# Altium schematic sheet Télécommande.SchDoc
size A4
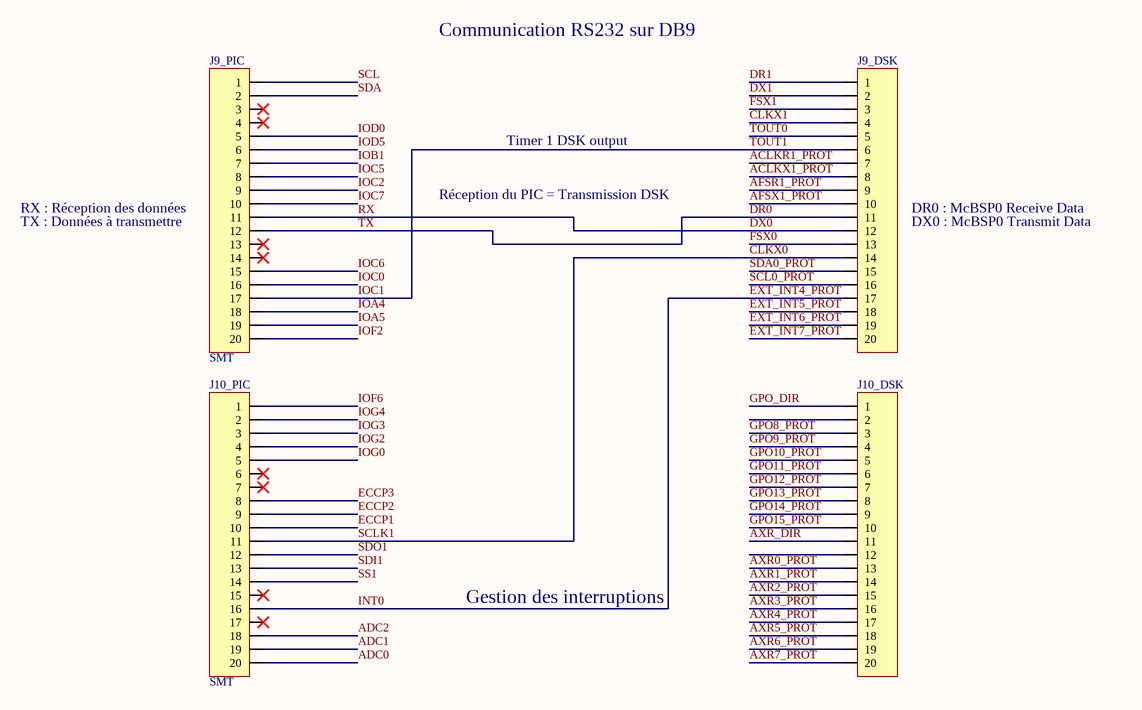
[diagram p0: Télécommande.SchDoc]

## Parts
J9_DSK  Conn20pinsF  [Conn_20_SMT]  (value not drawn)
J9_PIC  Package: SMT  [Conn_20_SMT]  (hidden comment: Conn20pinsF)
J10_DSK  Conn20pinsF  [Conn_20_SMT]  (value not drawn)
J10_PIC  Package: SMT  [Conn_20_SMT]  (hidden comment: Conn20pinsF)

## Nets
ACLKR1_PROT: J9_DSK.7
ACLKX1_PROT: J9_DSK.8
ADC0: J10_PIC.20
ADC1: J10_PIC.19
ADC2: J10_PIC.18
AFSR1_PROT: J9_DSK.9
AFSX1_PROT: J9_DSK.10
AXR0_PROT: J10_DSK.13
AXR1_PROT: J10_DSK.14
AXR2_PROT: J10_DSK.15
AXR3_PROT: J10_DSK.16
AXR4_PROT: J10_DSK.17
AXR5_PROT: J10_DSK.18
AXR6_PROT: J10_DSK.19
AXR7_PROT: J10_DSK.20
AXR_DIR: J10_DSK.11
CLKX0: J9_DSK.14 J10_PIC.11  [also labelled SCLK1]
CLKX1: J9_DSK.4
DR0: J9_DSK.11 J9_PIC.12  [also labelled TX]
DR1: J9_DSK.1
DX0: J9_DSK.12 J9_PIC.11  [also labelled RX]
DX1: J9_DSK.2
ECCP1: J10_PIC.10
ECCP2: J10_PIC.9
ECCP3: J10_PIC.8
EXT_INT4_PROT: J9_DSK.17 J10_PIC.16  [also labelled INT0]
EXT_INT5_PROT: J9_DSK.18
EXT_INT6_PROT: J9_DSK.19
EXT_INT7_PROT: J9_DSK.20
FSX0: J9_DSK.13
FSX1: J9_DSK.3
GPO8_PROT: J10_DSK.3
GPO9_PROT: J10_DSK.4
GPO10_PROT: J10_DSK.5
GPO11_PROT: J10_DSK.6
GPO12_PROT: J10_DSK.7
GPO13_PROT: J10_DSK.8
GPO14_PROT: J10_DSK.9
GPO15_PROT: J10_DSK.10
GPO_DIR: J10_DSK.1
IOA4: J9_PIC.18
IOA5: J9_PIC.19
IOB1: J9_PIC.7
IOC0: J9_PIC.16
IOC1: J9_DSK.6 J9_PIC.17  [also labelled TOUT1]
IOC2: J9_PIC.9
IOC5: J9_PIC.8
IOC6: J9_PIC.15
IOC7: J9_PIC.10
IOD0: J9_PIC.5
IOD5: J9_PIC.6
IOF2: J9_PIC.20
IOF6: J10_PIC.1
IOG0: J10_PIC.5
IOG2: J10_PIC.4
IOG3: J10_PIC.3
IOG4: J10_PIC.2
SCL: J9_PIC.1
SCL0_PROT: J9_DSK.16
SDA: J9_PIC.2
SDA0_PROT: J9_DSK.15
SDI1: J10_PIC.13
SDO1: J10_PIC.12
SS1: J10_PIC.14
TOUT0: J9_DSK.5

Not connected (* = marked no-connect by the designer): J9_PIC 3* 4* 13* 14*; J10_DSK 2 12; J10_PIC 6* 7* 15* 17*

## Notes on the sheet
- Communication RS232 sur DB9
- Timer 1 DSK output
- (near J9_PIC) RX : Réception des données
- Réception du PIC = Transmission DSK
- DR0 : McBSP0 Receive Data
- (near J9_PIC) TX : Données à transmettre
- DX0 : McBSP0 Transmit Data
- Gestion des interruptions

## Library data of the parts
J9_DSK J9_PIC J10_DSK J10_PIC = Conn20pinsF: Connecteur 20 pins F - pitch = 100mils; Manufacturer: Sullins Connector Solutions; Mfg Part Number: NPTC102KFMS-RC; Precision: *; Voltage: *; Current: *; Power: *; HelpURL: https://media.digikey.com/pdf/Data%20Sheets/Sullins%20PDFs/NPxCxx2KFMx-RC%2010488-D.pdf; CreatedBy: Olivier Bernard; VerifiedBy: *; FootprintNameOk: *; Value: 100 mils; NI: *; Supplier 1: Digi-Key; Supplier Part Number 1: S5680-ND
  J9_DSK J10_DSK: Package: SMT